# EAGLE design IVSTAGEV4 (EAGLE 5.07)
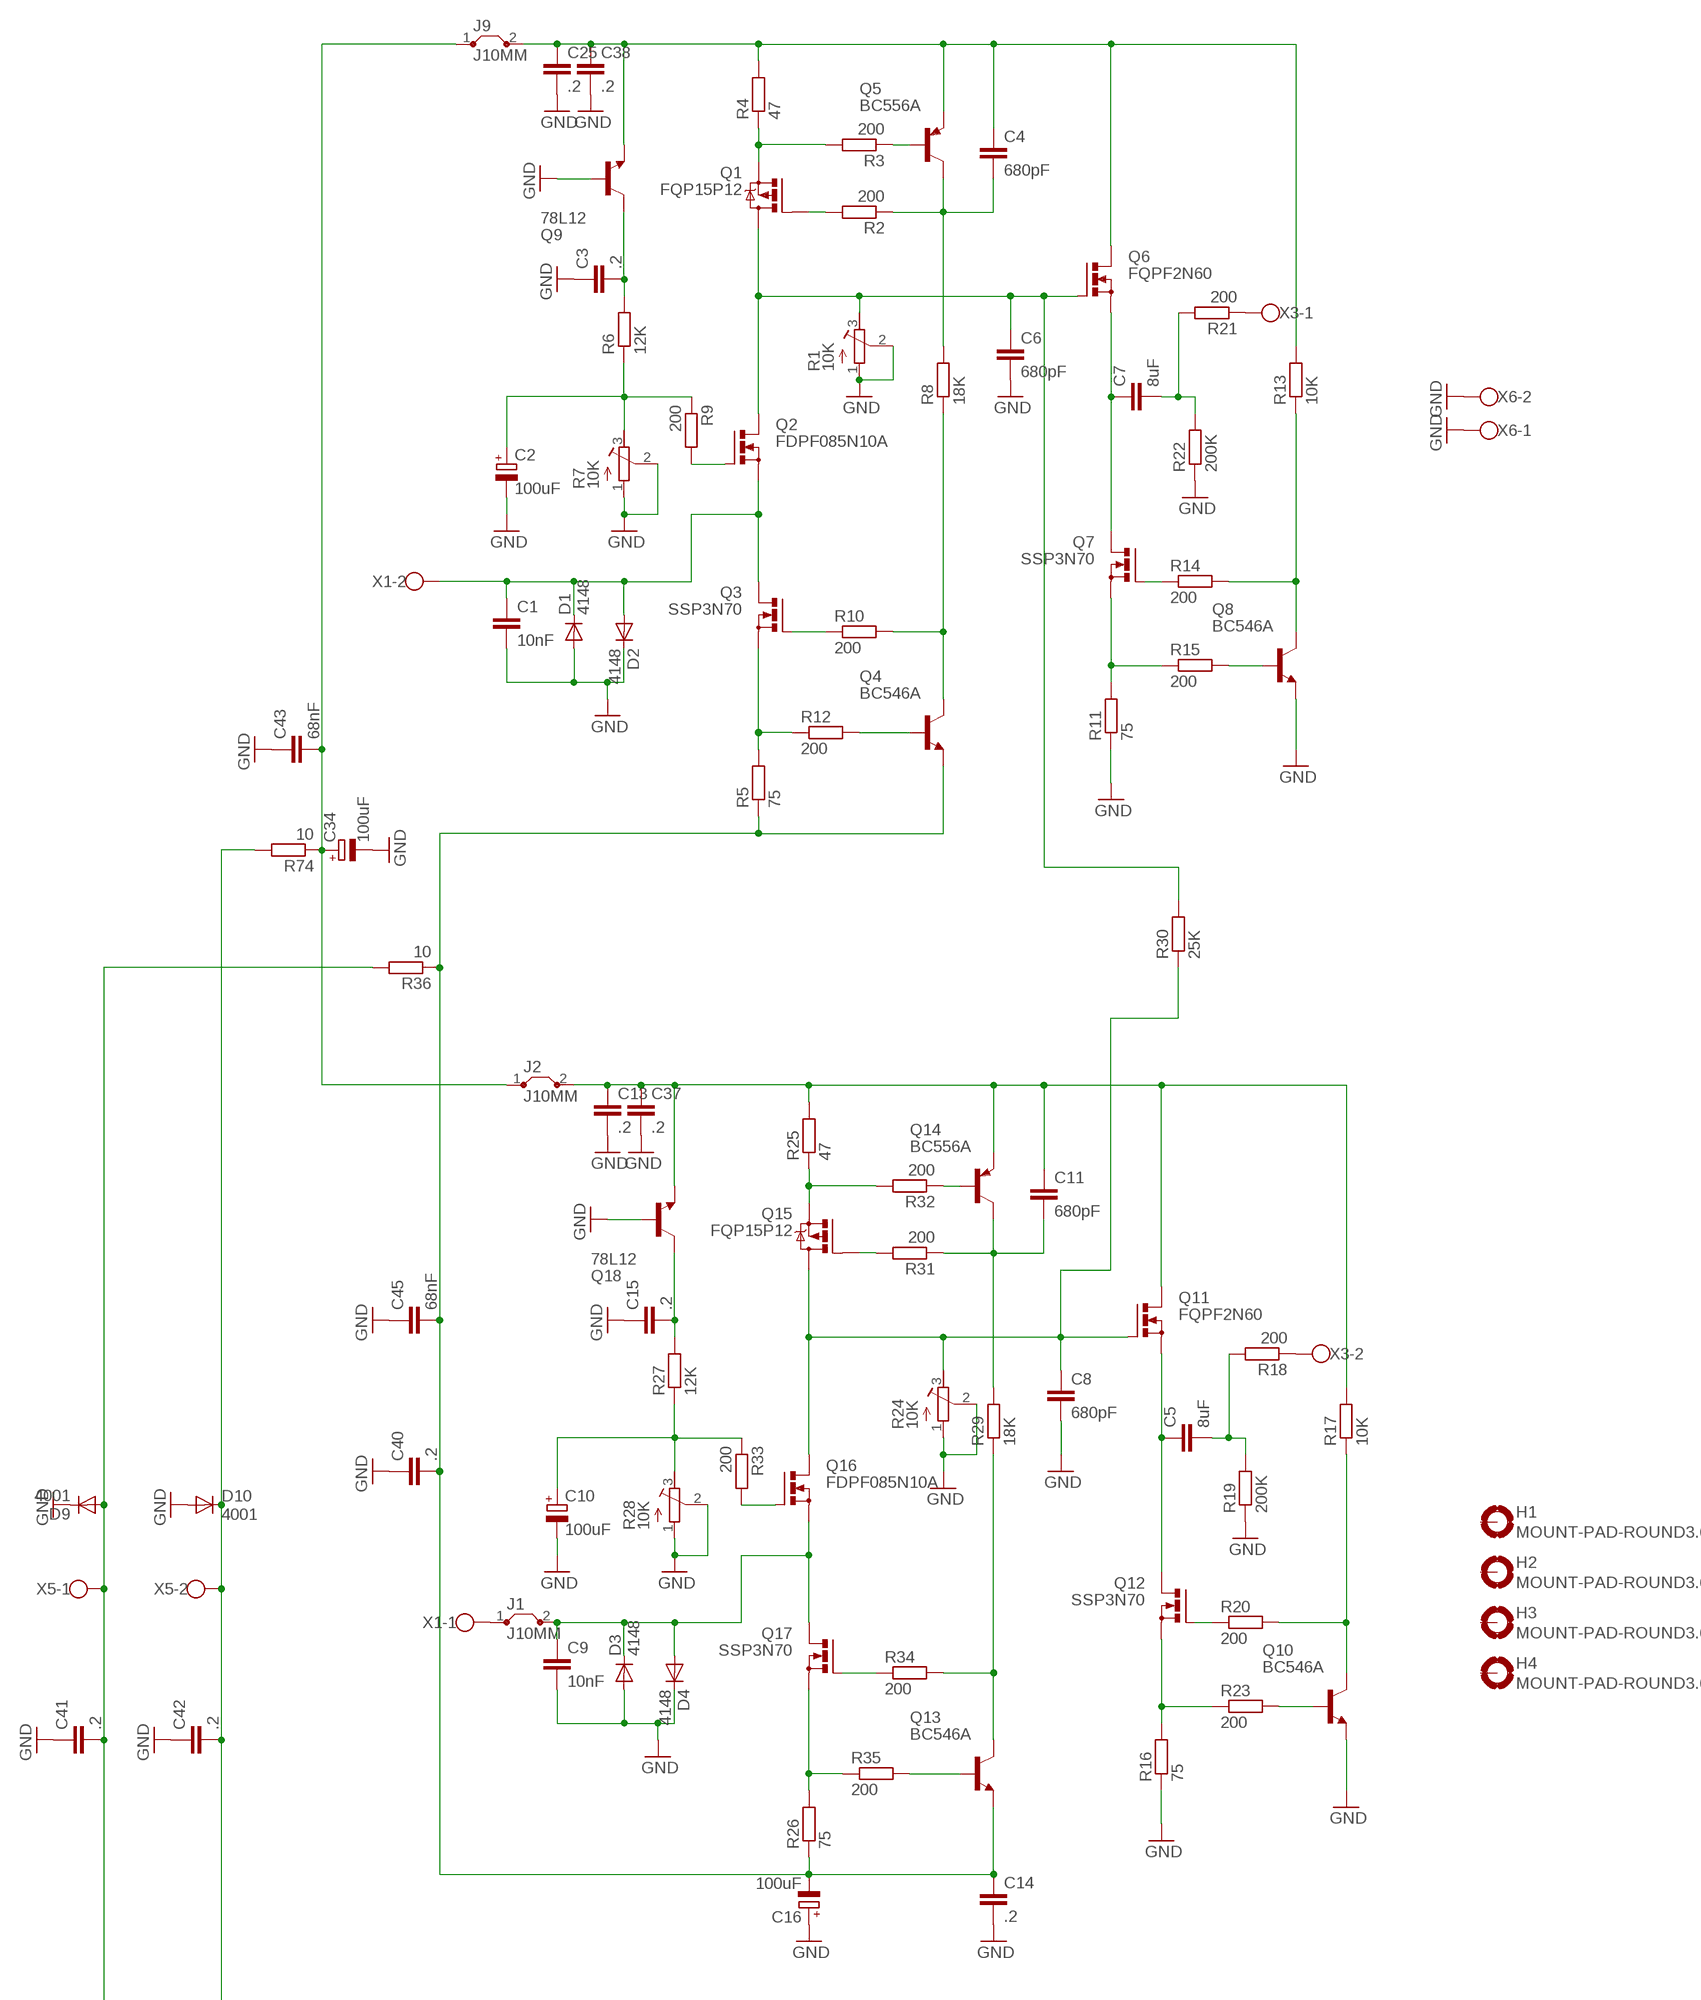
[diagram p0: schematic, sheet 1, part 1 of 2]
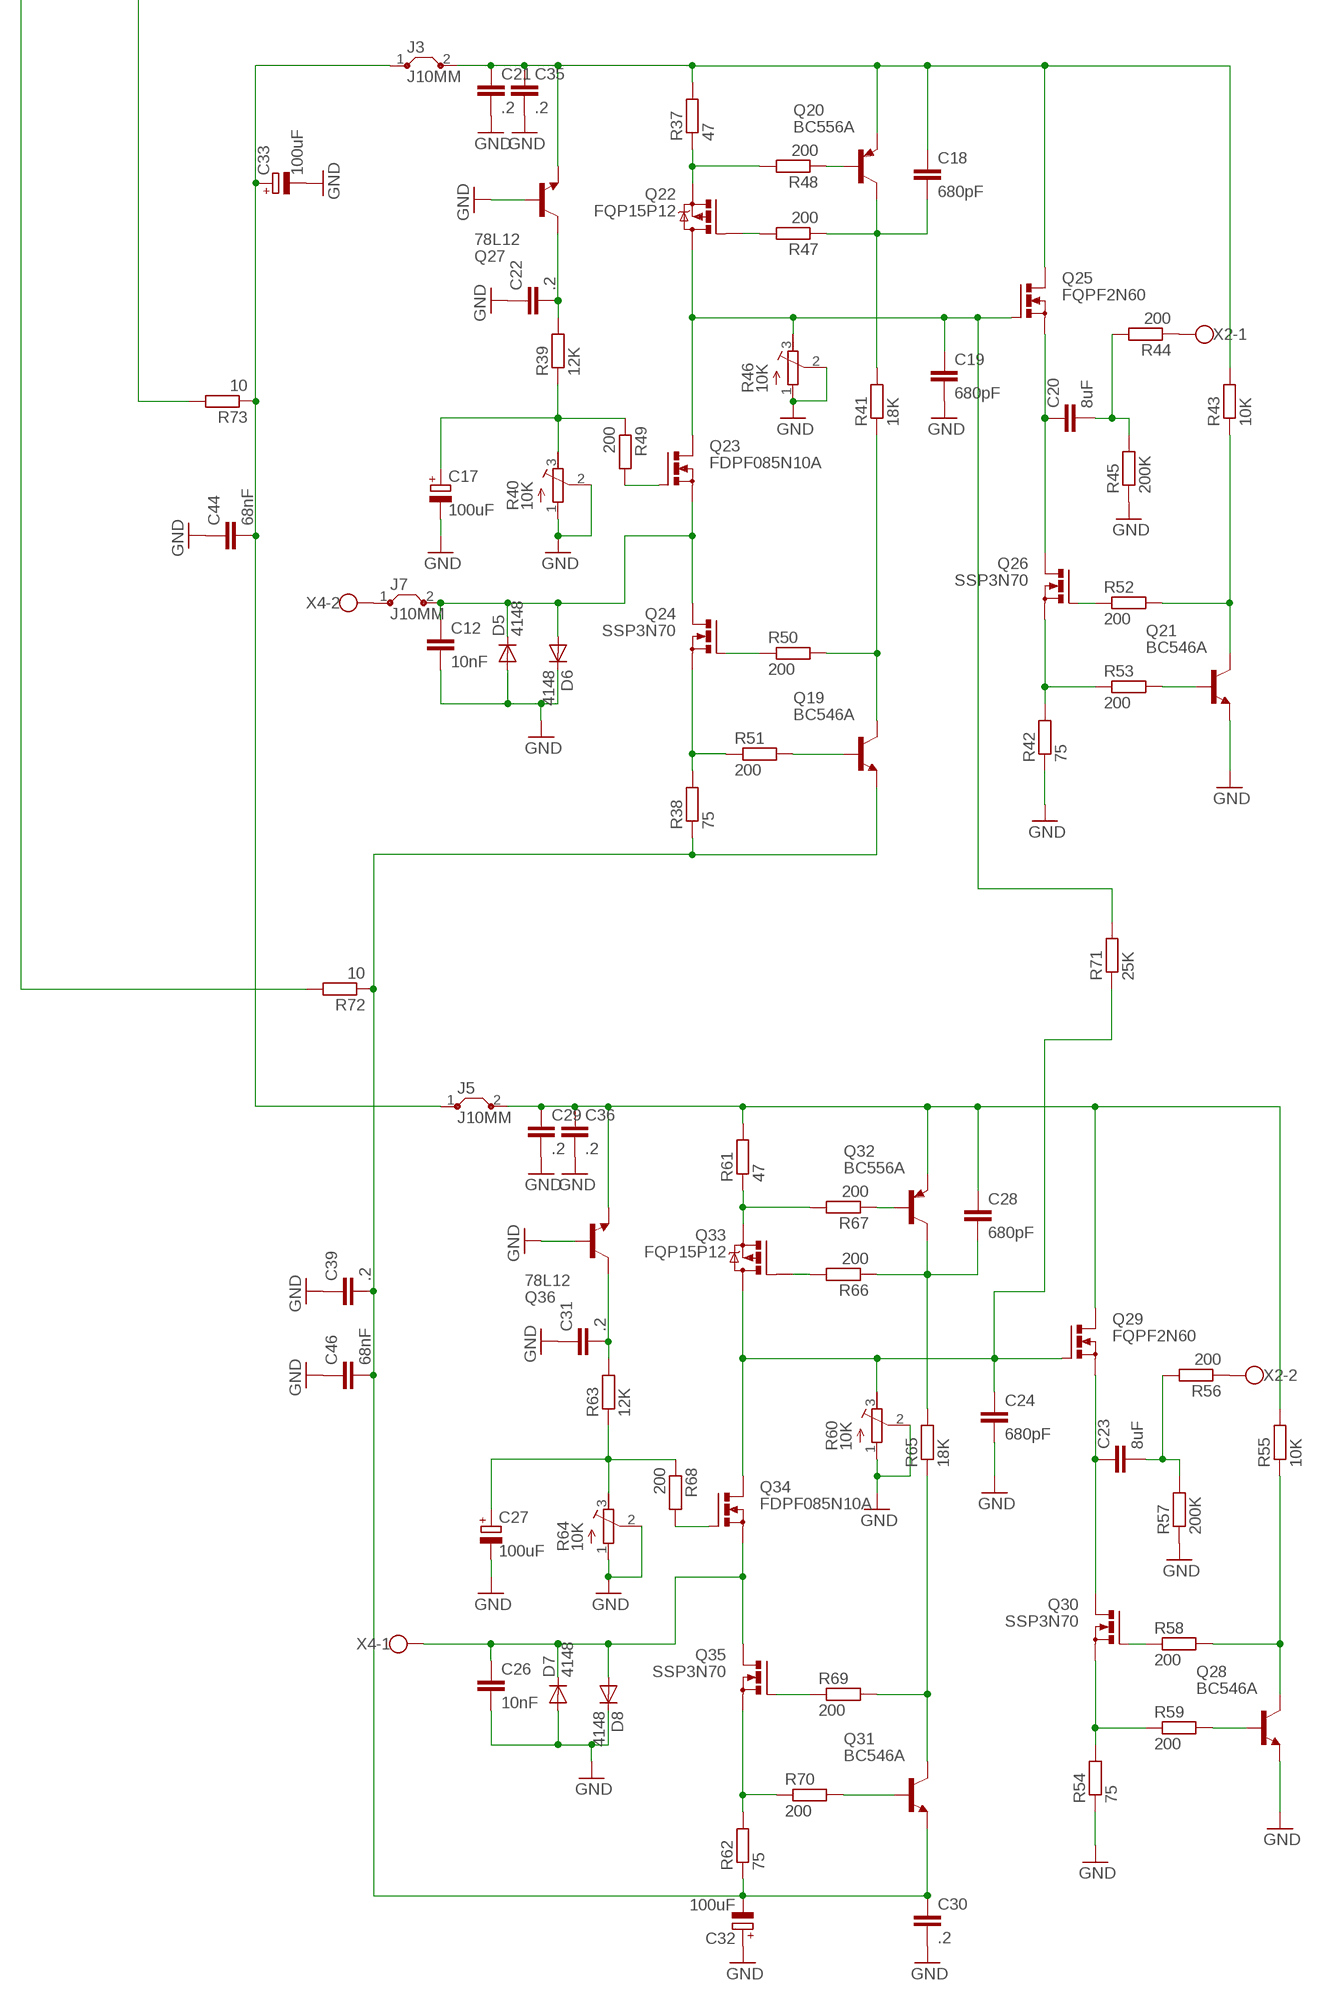
[diagram p1: schematic, sheet 1, part 2 of 2]

## Parts
C1  10nF  C-EU050-055X075  [C050-055X075]
C2  100uF  CPOL-EUE5-10.5  [E5-10,5]
C3  .2  C-EUC1210K  [C1210K]
C4  680pF  C-EU050-055X075  [C050-055X075]
C5  8uF  C-EU275-173X316  [C275-173X316]
C6  680pF  C-EU050-055X075  [C050-055X075]
C7  8uF  C-EU275-173X316  [C275-173X316]
C8  680pF  C-EU050-055X075  [C050-055X075]
C9  10nF  C-EU050-055X075  [C050-055X075]
C10  100uF  CPOL-EUE5-10.5  [E5-10,5]
C11  680pF  C-EU050-055X075  [C050-055X075]
C12  10nF  C-EU050-055X075  [C050-055X075]
C13  .2  C-EUC1210K  [C1210K]
C14  .2  C-EUC1210K  [C1210K]
C15  .2  C-EUC1210K  [C1210K]
C16  100uF  CPOL-EUE5-13  [E5-13]
C17  100uF  CPOL-EUE5-10.5  [E5-10,5]
C18  680pF  C-EU050-055X075  [C050-055X075]
C19  680pF  C-EU050-055X075  [C050-055X075]
C20  8uF  C-EU275-173X316  [C275-173X316]
C21  .2  C-EUC1210K  [C1210K]
C22  .2  C-EUC1210K  [C1210K]
C23  8uF  C-EU275-173X316  [C275-173X316]
C24  680pF  C-EU050-055X075  [C050-055X075]
C25  .2  C-EUC1210K  [C1210K]
C26  10nF  C-EU050-055X075  [C050-055X075]
C27  100uF  CPOL-EUE5-10.5  [E5-10,5]
C28  680pF  C-EU050-055X075  [C050-055X075]
C29  .2  C-EUC1210K  [C1210K]
C30  .2  C-EUC1210K  [C1210K]
C31  .2  C-EUC1210K  [C1210K]
C32  100uF  CPOL-EUE5-13  [E5-13]
C33  100uF  CPOL-EUE5-13  [E5-13]
C34  100uF  CPOL-EUE5-13  [E5-13]
C35  .2  C-EUC1210K  [C1210K]
C36  .2  C-EUC1210K  [C1210K]
C37  .2  C-EUC1210K  [C1210K]
C38  .2  C-EUC1210K  [C1210K]
C39  .2  C-EUC1210K  [C1210K]
C40  .2  C-EUC1210K  [C1210K]
C41  .2  C-EUC1210K  [C1210K]
C42  .2  C-EUC1210K  [C1210K]
C43  68nF  C-EU075-052X106  [C075-052X106]
C44  68nF  C-EU075-052X106  [C075-052X106]
C45  68nF  C-EU075-052X106  [C075-052X106]
C46  68nF  C-EU075-052X106  [C075-052X106]
D1  4148  1N4148DO35-7  [DO35-7]
D2  4148  1N4148DO35-7  [DO35-7]
D3  4148  1N4148DO35-7  [DO35-7]
D4  4148  1N4148DO35-7  [DO35-7]
D5  4148  1N4148DO35-7  [DO35-7]
D6  4148  1N4148DO35-7  [DO35-7]
D7  4148  1N4148DO35-7  [DO35-7]
D8  4148  1N4148DO35-7  [DO35-7]
D9  4001  1N4148DO35-7  [DO35-7]
D10  4001  1N4148DO35-7  [DO35-7]
H1  MOUNT-PAD-ROUND3.6  [3,6-PAD]
H2  MOUNT-PAD-ROUND3.6  [3,6-PAD]
H3  MOUNT-PAD-ROUND3.6  [3,6-PAD]
H4  MOUNT-PAD-ROUND3.6  [3,6-PAD]
J1  J10MM  [10]
J2  J10MM  [10]
J3  J10MM  [10]
J5  J10MM  [10]
J7  J10MM  [10]
J9  J10MM  [10]
Q1  FQP15P12  IRF9530  [TO220BV]
Q2  FDPF085N10A  IRF512  [TO220BV]
Q3  SSP3N70  IRF512  [TO220BV]
Q4  BC546A  [TO92-EBC]
Q5  BC556A  BC556  [TO92-EBC]
Q6  FQPF2N60  IRF512  [TO220BV]
Q7  SSP3N70  IRF512  [TO220BV]
Q8  BC546A  [TO92-EBC]
Q9  78L12  BC546A  [TO92-EBC]
Q10  BC546A  [TO92-EBC]
Q11  FQPF2N60  IRF512  [TO220BV]
Q12  SSP3N70  IRF512  [TO220BV]
Q13  BC546A  [TO92-EBC]
Q14  BC556A  BC556  [TO92-EBC]
Q15  FQP15P12  IRF9530  [TO220BV]
Q16  FDPF085N10A  IRF512  [TO220BV]
Q17  SSP3N70  IRF512  [TO220BV]
Q18  78L12  BC546A  [TO92-EBC]
Q19  BC546A  [TO92-EBC]
Q20  BC556A  BC556  [TO92-EBC]
Q21  BC546A  [TO92-EBC]
Q22  FQP15P12  IRF9530  [TO220BV]
Q23  FDPF085N10A  IRF512  [TO220BV]
Q24  SSP3N70  IRF512  [TO220BV]
Q25  FQPF2N60  IRF512  [TO220BV]
Q26  SSP3N70  IRF512  [TO220BV]
Q27  78L12  BC546A  [TO92-EBC]
Q28  BC546A  [TO92-EBC]
Q29  FQPF2N60  IRF512  [TO220BV]
Q30  SSP3N70  IRF512  [TO220BV]
Q31  BC546A  [TO92-EBC]
Q32  BC556A  BC556  [TO92-EBC]
Q33  FQP15P12  IRF9530  [TO220BV]
Q34  FDPF085N10A  IRF512  [TO220BV]
Q35  SSP3N70  IRF512  [TO220BV]
Q36  78L12  BC546A  [TO92-EBC]
R1  10K  R-TRIMM3296W  [RTRIM3296W]
R2  200  R-EU_0207/10  [0207/10]
R3  200  R-EU_0207/10  [0207/10]
R4  47  R-EU_0207/10  [0207/10]
R5  75  R-EU_0207/10  [0207/10]
R6  12K  R-EU_0204/7  [0204/7]
R7  10K  R-TRIMM3296W  [RTRIM3296W]
R8  18K  R-EU_0309/12  [0309/12]
R9  200  R-EU_0207/10  [0207/10]
R10  200  R-EU_0207/10  [0207/10]
R11  75  R-EU_0207/10  [0207/10]
R12  200  R-EU_0207/10  [0207/10]
R13  10K  R-EU_0309/12  [0309/12]
R14  200  R-EU_0207/10  [0207/10]
R15  200  R-EU_0207/10  [0207/10]
R16  75  R-EU_0207/10  [0207/10]
R17  10K  R-EU_0309/12  [0309/12]
R18  200  R-EU_0207/10  [0207/10]
R19  200K  R-EU_0207/10  [0207/10]
R20  200  R-EU_0207/10  [0207/10]
R21  200  R-EU_0207/10  [0207/10]
R22  200K  R-EU_0207/10  [0207/10]
R23  200  R-EU_0207/10  [0207/10]
R24  10K  R-TRIMM3296W  [RTRIM3296W]
R25  47  R-EU_0207/10  [0207/10]
R26  75  R-EU_0207/10  [0207/10]
R27  12K  R-EU_0204/7  [0204/7]
R28  10K  R-TRIMM3296W  [RTRIM3296W]
R29  18K  R-EU_0309/12  [0309/12]
R30  25K  R-EU_0207/10  [0207/10]
R31  200  R-EU_0207/10  [0207/10]
R32  200  R-EU_0207/10  [0207/10]
R33  200  R-EU_0207/10  [0207/10]
R34  200  R-EU_0207/10  [0207/10]
R35  200  R-EU_0207/10  [0207/10]
R36  10  R-EU_0207/10  [0207/10]
R37  47  R-EU_0207/10  [0207/10]
R38  75  R-EU_0207/10  [0207/10]
R39  12K  R-EU_0204/7  [0204/7]
R40  10K  R-TRIMM3296W  [RTRIM3296W]
R41  18K  R-EU_0309/12  [0309/12]
R42  75  R-EU_0207/10  [0207/10]
R43  10K  R-EU_0309/12  [0309/12]
R44  200  R-EU_0207/10  [0207/10]
R45  200K  R-EU_0207/10  [0207/10]
R46  10K  R-TRIMM3296W  [RTRIM3296W]
R47  200  R-EU_0207/10  [0207/10]
R48  200  R-EU_0207/10  [0207/10]
R49  200  R-EU_0207/10  [0207/10]
R50  200  R-EU_0207/10  [0207/10]
R51  200  R-EU_0207/10  [0207/10]
R52  200  R-EU_0207/10  [0207/10]
R53  200  R-EU_0207/10  [0207/10]
R54  75  R-EU_0207/10  [0207/10]
R55  10K  R-EU_0309/12  [0309/12]
R56  200  R-EU_0207/10  [0207/10]
R57  200K  R-EU_0207/10  [0207/10]
R58  200  R-EU_0207/10  [0207/10]
R59  200  R-EU_0207/10  [0207/10]
R60  10K  R-TRIMM3296W  [RTRIM3296W]
R61  47  R-EU_0207/10  [0207/10]
R62  75  R-EU_0207/10  [0207/10]
R63  12K  R-EU_0204/7  [0204/7]
R64  10K  R-TRIMM3296W  [RTRIM3296W]
R65  18K  R-EU_0309/12  [0309/12]
R66  200  R-EU_0207/10  [0207/10]
R67  200  R-EU_0207/10  [0207/10]
R68  200  R-EU_0207/10  [0207/10]
R69  200  R-EU_0207/10  [0207/10]
R70  200  R-EU_0207/10  [0207/10]
R71  25K  R-EU_0207/10  [0207/10]
R72  10  R-EU_0207/10  [0207/10]
R73  10  R-EU_0207/10  [0207/10]
R74  10  R-EU_0207/10  [0207/10]
X1  W237-02P  [W237-132]
X2  W237-02P  [W237-132]
X3  W237-02P  [W237-132]
X4  W237-02P  [W237-132]
X5  W237-02P  [W237-132]
X6  W237-02P  [W237-132]

## Nets
GND: C1.2 C2.- C3.1 C6.2 C8.2 C9.2 C10.- C12.2 C13.2 C14.2 C15.1 C16.+ C17.- C19.2 C21.2 C22.1 C24.2 C25.2 C26.2 C27.- C29.2 C30.2 C31.1 C32.+ C33.- C34.- C35.2 C36.2 C37.2 C38.2 C39.1 C40.1 C41.1 C42.1 C43.1 C44.1 C45.1 C46.1 D1.A D2.C D3.A D4.C D5.A D6.C D7.A D8.C D9.C D10.A Q8.E Q9.B Q10.E Q18.B Q21.E Q27.B Q28.E Q36.B R1.1(E) R1.2(S) R7.1(E) R7.2(S) R11.1 R16.1 R19.1 R22.1 R24.1(E) R24.2(S) R28.1(E) R28.2(S) R40.1(E) R40.2(S) R42.1 R45.1 R46.1(E) R46.2(S) R54.1 R57.1 R60.1(E) R60.2(S) R64.1(E) R64.2(S) X6.1 X6.2
N$1: C6.1 Q1.D Q2.D Q6.G R1.3(A) R30.2
N$2: C1.1 D1.C D2.A Q2.S Q3.D X1.2
N$3: C2.+ R6.1 R7.3(A) R9.1
N$4: Q1.G R2.2
N$5: C3.2 Q9.C R6.2
N$6: Q1.S R3.2 R4.1
N$7: Q3.S R5.2 R12.1
N$8: Q4.C R8.1 R10.2
N$9: C4.2 Q5.C R2.1 R8.2
N$10: C14.1 C16.- C40.2 C45.2 Q4.E Q13.E R5.1 R26.1 R36.1
N$11: C4.1 C25.1 C38.1 J9.2 Q5.E Q6.D Q9.E R4.2 R13.2
N$12: Q5.B R3.1
N$13: C7.1 Q6.S Q7.D
N$14: Q7.S R11.2 R15.1
N$15: Q2.G R9.2
N$16: Q8.C R13.1 R14.2
N$17: Q3.G R10.1
N$18: Q4.B R12.2
N$19: Q7.G R14.1
N$20: Q8.B R15.2
N$21: R21.1 X3.1
N$22: C41.2 D9.A R36.2 R72.2 X5.1
N$23: C5.1 Q11.S Q12.D
N$24: Q12.S R16.2 R23.1
N$25: Q10.C R17.1 R20.2
N$26: C7.2 R21.2 R22.2
N$27: C5.2 R18.2 R19.2
N$28: Q12.G R20.1
N$29: Q10.B R23.2
N$30: C8.1 Q11.G Q15.D Q16.D R24.3(A) R30.1
N$31: C9.1 D3.C D4.A J1.2 Q16.S Q17.D
N$32: C10.+ R27.1 R28.3(A) R33.1
N$42: Q15.S R25.1 R32.2
N$43: Q17.S R26.2 R35.1
N$44: Q13.C R29.1 R34.2
N$45: C11.2 Q14.C R29.2 R31.1
N$52: R18.1 X3.2
N$53: C42.2 D10.C R73.2 R74.2 X5.2
N$55: C34.+ C43.2 J2.1 J9.1 R74.1
N$56: C15.2 Q18.C R27.2
N$57: C19.1 Q22.D Q23.D Q25.G R46.3(A) R71.2
N$58: Q15.G R31.2
N$59: Q14.B R32.1
N$60: Q16.G R33.2
N$61: Q17.G R34.1
N$62: Q13.B R35.2
N$63: J1.1 X1.1
N$64: C12.1 D5.C D6.A J7.2 Q23.S Q24.D
N$65: C17.+ R39.1 R40.3(A) R49.1
N$66: Q22.S R37.1 R48.2
N$67: Q24.S R38.2 R51.1
N$68: Q19.C R41.1 R50.2
N$69: C18.2 Q20.C R41.2 R47.1
N$70: C30.1 C32.- C39.2 C46.2 Q19.E Q31.E R38.1 R62.1 R72.1
N$71: C18.1 C21.1 C35.1 J3.2 Q20.E Q25.D Q27.E R37.2 R43.2
N$72: C20.1 Q25.S Q26.D
N$73: Q26.S R42.2 R53.1
N$74: Q21.C R43.1 R52.2
N$75: C20.2 R44.2 R45.2
N$76: C22.2 Q27.C R39.2
N$77: Q22.G R47.2
N$78: Q20.B R48.1
N$79: Q23.G R49.2
N$80: Q24.G R50.1
N$81: Q19.B R51.2
N$82: Q26.G R52.1
N$83: Q21.B R53.2
N$84: Q29.D R55.2
N$85: C23.1 Q29.S Q30.D
N$86: Q30.S R54.2 R59.1
N$87: Q28.C R55.1 R58.2
N$88: C23.2 R56.2 R57.2
N$89: Q30.G R58.1
N$90: Q28.B R59.2
N$91: C24.1 Q29.G Q33.D Q34.D R60.3(A) R71.1
N$92: C26.1 D7.C D8.A Q34.S Q35.D X4.1
N$93: C27.+ R63.1 R64.3(A) R68.1
N$94: Q33.S R61.1 R67.2
N$95: Q35.S R62.2 R70.1
N$96: Q31.C R65.1 R69.2
N$97: C28.2 Q32.C R65.2 R66.1
N$98: C28.1 C29.1 C36.1 J5.2 Q32.E Q36.E R61.2
N$99: C33.+ C44.2 J3.1 J5.1 R73.1
N$100: C31.2 Q36.C R63.2
N$101: Q33.G R66.2
N$102: Q32.B R67.1
N$103: Q34.G R68.2
N$104: Q35.G R69.1
N$105: Q31.B R70.2
N$106: R44.1 X2.1
N$107: R56.1 X2.2
N$108: J7.1 X4.2
N$110: C11.1 C13.1 C37.1 J2.2 Q11.D Q14.E Q18.E R17.2 R25.2
Unconnected: H1.B3,6(MOUNT) H2.B3,6(MOUNT) H3.B3,6(MOUNT) H4.B3,6(MOUNT)

## Library data of the parts
C1 C3-C9 C11-C15 C18-C26 C28-C31 C35-C46 = resistor:C-EU: CAPACITOR, European symbol
C2 C10 C16 C17 C27 C32-C34 = resistor:CPOL-EU: POLARIZED CAPACITOR, European symbol
D1-D10 = diode:1N4148: DIODE high speed (Philips)
H1-H4 = holes:MOUNT-PAD-ROUND: MOUNTING PAD, round
J1-J3 J5 J7 J9 = jumper:J: Bridge
Q1 Q15 Q22 Q33 = transistor-power:IRF9530: P-CHANNEL HEXFET POWER-MOS-FET Source: http://www.irf.com/product-info/datasheets/data/irf9530.pdf
Q2 Q3 Q6 Q7 Q11 Q12 Q16 Q17 Q23-Q26 Q29 Q30 Q34 Q35 = transistor-power:IRF512: N-CHANNEL MOS FET
Q4 Q8-Q10 Q13 Q18 Q19 Q21 Q27 Q28 Q31 Q36 = transistor-npn:BC546*: NPN Transistor
Q5 Q14 Q20 Q32 = transistor-pnp:BC556*: PNP Transistror
R1 R7 R24 R28 R40 R46 R60 R64 = resistor:R-TRIMM: Trimm resistor
R2-R6 R8-R23 R25-R27 R29-R39 R41-R45 R47-R59 R61-R63 R65-R74 = resistor:R-EU_: RESISTOR, European symbol
X1-X6 = con-wago-508:W237-02P: WAGO SREW CLAMP

## Board
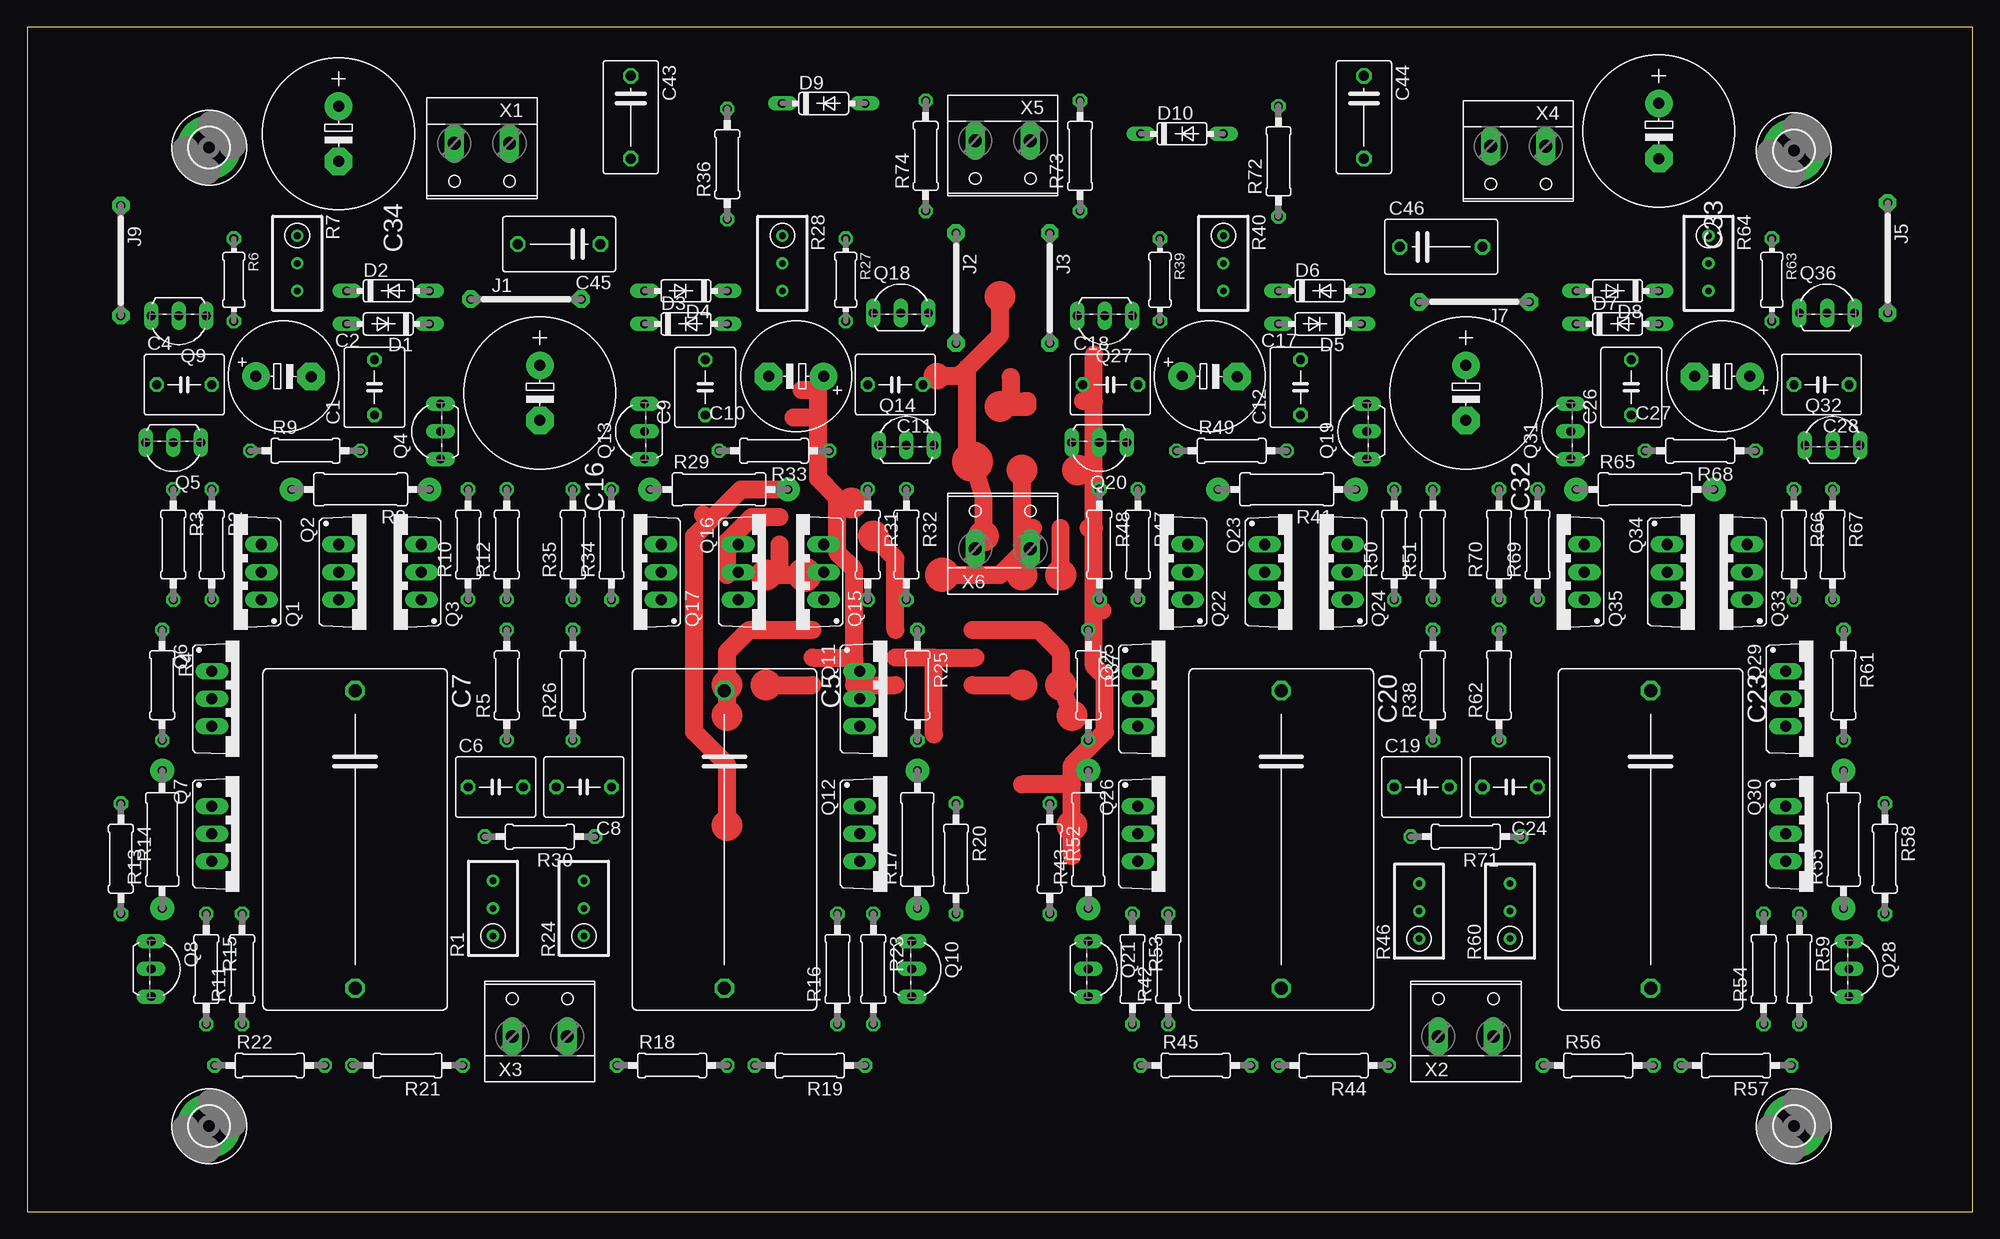
[diagram p2: board, top side]
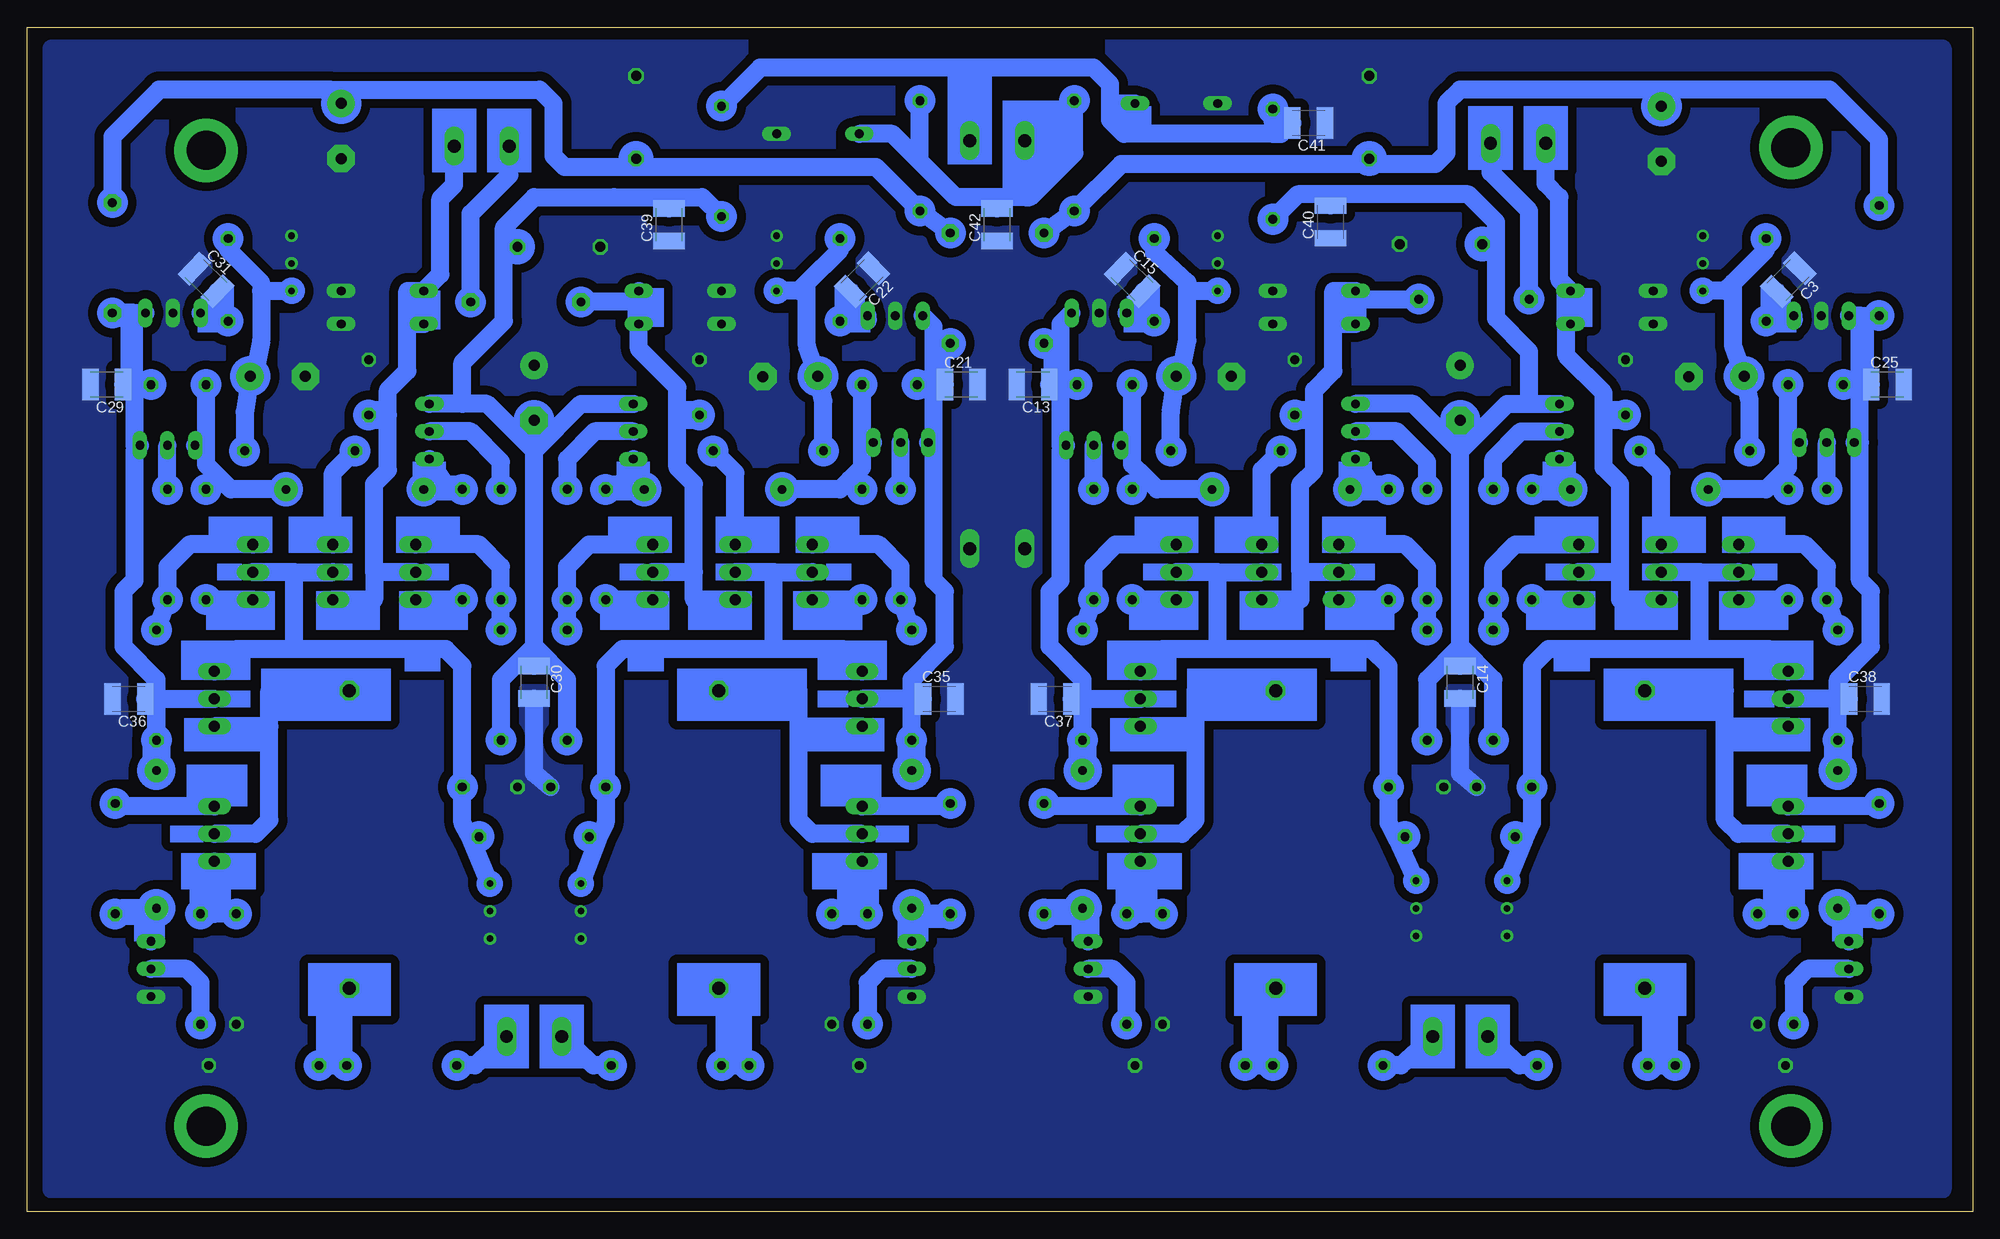
[diagram p3: board, bottom side, seen from below]

Size 179.3 x 109.14 mm. Coordinates in mm from the lower left corner, seen from the top.
Outline: 0,0 179.3,0 179.3,109.14 0,109.14 0,0
Copper layers (1*16): Top 0.035mm / dielectric 1.5mm / Bottom 0.035mm
Design rules "default *": minimum track width 10mil, minimum drill 24mil, track to track 8mil, track to pad 8mil, pad to pad 8mil, via to via 8mil, smd to smd 8mil, copper to edge 40mil, drill to drill 8mil, minimum pad ring 10mil, minimum via ring 8mil, stop-mask expansion 4mil, vias tented up to drill 0mil, thermal gap 10mil

### Footprints (pad centres in the part's own frame; a part is rotated, then mirrored left to right if it is on the bottom)
C050-055X075 = drill 0.813 octagon: 1 -2.54,0; 2 2.54,0
E5-10,5 = drill 1.016 pad 2.54 round: + -2.54,0 | drill 1.016 pad 2.54 octagon: - 2.54,0
C1210K = smd 1.5 x 2.9: 1 -1.5,0; 2 1.5,0
C275-173X316 = drill 1.194 octagon: 1 -13.716,0; 2 13.716,0
E5-13 = drill 1.016 pad 2.54 round: + -2.54,0 | drill 1.016 pad 2.54 octagon: - 2.54,0
C075-052X106 = drill 0.914 octagon: 1 -3.81,0; 2 3.81,0
DO35-7 = drill 0.813 long: A 3.81,0; C -3.81,0
3,6-PAD = drill 3.6 pad 5.842 round: B3,6 0,0
10 = drill 0.813 pad 1.6 octagon: 1 -5.08,0; 2 5.08,0
TO220BV = drill 1.016 long: D 0,-2.54; G -2.54,-2.54; S 2.54,-2.54
TO92-EBC = drill 0.813 long: B 0,-1.27; C -2.54,-1.27; E 2.54,-1.27
RTRIM3296W = drill 0.61 round: 1 0,-2.54; 2 0,0; 3 0,2.54
0207/10 = drill 0.813 octagon: 1 -5.08,0; 2 5.08,0
0204/7 = drill 0.813 octagon: 1 -3.81,0; 2 3.81,0
0309/12 = drill 0.8 pad 2.184 round: 1 -6.35,0; 2 6.35,0
W237-132 = drill 1.194 long: 1 -2.54,-0.635; 2 2.54,-0.635

### Placement (x,y rotation side)
C1  32,75.95 90 top
C2  23.62,76.96 359.3 top
C3  17.02,85.85 225 bottom
C4  14.48,76.2 0 top
C5  64.26,34.29 270 top
C6  43.18,39.12 0 top
C7  30.23,34.29 270 top
C8  51.31,39.12 180 top
C9  62.48,75.95 90 top
C10  70.87,76.96 180 top
C11  80.01,76.2 180 top
C12  117.35,75.95 90 top
C13  86.61,76.2 180 bottom
C14  47.24,48.77 270 bottom
C15  77.47,85.85 315.9 bottom
C16  47.24,75.44 270 top
C17  108.97,76.96 359.3 top
C18  99.82,76.2 0 top
C19  128.52,39.12 0 top
C20  115.57,34.29 270 top
C21  93.22,76.2 0 bottom
C22  102.36,85.85 225 bottom
C23  149.61,34.29 270 top
C24  136.65,39.12 180 top
C25  7.87,76.2 0 bottom
C26  147.83,75.95 90 top
C27  156.21,76.96 180 top
C28  165.35,76.2 180 top
C29  171.96,76.2 180 bottom
C30  132.59,48.77 270 bottom
C31  162.81,85.85 315.9 bottom
C32  132.59,75.44 270 top
C33  150.37,99.57 270 top
C34  28.7,99.31 270 top
C35  95.25,47.24 0 bottom
C36  169.93,47.24 180 bottom
C37  84.58,47.24 180 bottom
C38  9.91,47.24 0 bottom
C39  120.14,90.93 90 bottom
C40  59.18,91.19 90 bottom
C41  61.21,100.33 180 bottom
C42  89.92,90.93 90 bottom
C43  55.63,100.84 270 top
C44  123.19,100.84 270 top
C45  49.02,89.15 180 top
C46  130.3,88.9 0 top
D1  33.27,81.79 180 top
D2  33.27,84.84 0 top
D3  60.71,81.79 0 top
D4  60.71,84.84 180 top
D5  119.13,81.79 180 top
D6  119.13,84.84 0 top
D7  146.56,81.79 0 top
D8  146.56,84.84 180 top
D9  73.41,102.11 0 top
D10  106.43,99.31 0 top
H1  16.76,7.87 0 top
H2  162.81,7.87 0 top
H3  16.76,98.04 0 top
H4  162.81,97.79 0 top
J1  45.97,84.07 0 top
J2  85.6,85.09 270 top
J3  94.23,85.09 270 top
J5  171.45,87.88 270 top
J7  133.35,83.82 180 top
J9  8.64,87.63 270 top
Q1  19.05,58.93 90 top
Q2  31.24,58.93 270 top
Q3  33.78,58.93 90 top
Q4  36.83,71.88 90 top
Q5  13.46,69.6 180 top
Q6  19.56,47.24 270 top
Q7  19.56,34.8 270 top
Q8  12.7,22.35 270 top
Q9  13.97,81.28 180 top
Q10  82.8,22.35 270 top
Q11  79.25,47.24 270 top
Q12  79.25,34.8 270 top
Q13  55.63,71.88 90 top
Q14  81.03,71.88 0 top
Q15  70.87,58.93 90 top
Q16  68.07,58.93 270 top
Q17  55.88,58.93 90 top
Q18  80.52,84.07 0 top
Q19  122.17,71.88 90 top
Q20  98.81,69.6 180 top
Q21  99.06,22.35 270 top
Q22  104.39,58.93 90 top
Q23  116.59,58.93 270 top
Q24  119.13,58.93 90 top
Q25  104.9,47.24 270 top
Q26  104.9,34.8 270 top
Q27  99.31,81.28 180 top
Q28  169.16,22.35 270 top
Q29  164.59,47.24 270 top
Q30  164.59,34.8 270 top
Q31  140.97,71.88 90 top
Q32  166.37,71.88 0 top
Q33  155.96,58.93 90 top
Q34  153.67,58.93 270 top
Q35  140.97,58.93 90 top
Q36  165.86,84.07 0 top
R1  42.93,27.94 0 top
R2  17.02,61.47 270 top
R3  13.46,61.47 270 top
R4  12.45,48.51 270 top
R5  44.2,48.51 90 top
R6  19.05,85.85 270 top
R7  24.89,87.38 180 top
R8  30.73,66.55 180 top
R9  25.65,70.1 0 top
R10  40.64,61.47 90 top
R11  19.81,22.35 90 top
R12  44.2,61.47 90 top
R13  12.45,34.29 90 top
R14  8.64,32.51 270 top
R15  16.51,22.35 270 top
R16  74.68,22.35 90 top
R17  82.04,34.29 90 top
R18  59.44,13.46 0 top
R19  72.14,13.46 180 top
R20  85.6,32.51 270 top
R21  35.05,13.46 180 top
R22  22.35,13.46 0 top
R23  77.98,22.35 270 top
R24  51.31,27.94 0 top
R25  82.04,48.51 270 top
R26  50.29,48.51 90 top
R27  75.44,85.85 270 top
R28  69.6,87.38 180 top
R29  63.75,66.55 0 top
R30  47.24,34.54 180 top
R31  77.47,61.47 270 top
R32  81.03,61.47 270 top
R33  68.83,70.1 180 top
R34  53.85,61.47 90 top
R35  50.29,61.47 90 top
R36  64.52,96.52 90 top
R37  97.79,48.51 270 top
R38  129.54,48.51 90 top
R39  104.39,85.85 270 top
R40  110.24,87.38 180 top
R41  116.08,66.55 180 top
R42  105.16,22.35 90 top
R43  97.79,34.29 90 top
R44  120.4,13.46 180 top
R45  107.7,13.46 0 top
R46  128.27,27.69 0 top
R47  102.36,61.47 270 top
R48  98.81,61.47 270 top
R49  111,70.1 0 top
R50  125.98,61.47 90 top
R51  129.54,61.47 90 top
R52  94.23,32.51 270 top
R53  101.85,22.35 270 top
R54  160.02,22.35 90 top
R55  167.39,34.29 90 top
R56  144.78,13.46 0 top
R57  157.48,13.46 180 top
R58  171.2,32.51 270 top
R59  163.32,22.35 270 top
R60  136.65,27.69 0 top
R61  167.39,48.51 270 top
R62  135.64,48.51 90 top
R63  160.78,85.85 270 top
R64  154.94,87.38 180 top
R65  149.1,66.55 0 top
R66  162.81,61.47 270 top
R67  166.37,61.47 270 top
R68  154.18,70.1 180 top
R69  139.19,61.47 90 top
R70  135.64,61.47 90 top
R71  132.59,34.54 180 top
R72  115.32,96.77 90 top
R73  97.03,97.28 90 top
R74  82.8,97.28 90 top
X1  41.91,97.79 180 top
X2  132.59,16.76 0 top
X3  47.24,16.76 0 top
X4  137.41,97.54 180 top
X5  89.92,98.04 180 top
X6  89.92,61.72 0 top

### Tracks (layer width: path | path; a pad name or v marks a point on that pad's centre or on a via)
GND
  Bottom 1.676: C6.2 47.24,40.39 C14.2 | C19.2 132.59,40.39 C30.2
  pour Bottom (isolate 0.813, no thermals): 2.79,107.19 2.79,2.03 177.04,2.03 177.04,107.19
N$1
  Bottom 1.676: 25.15,58.93 Q1.D | 25.15,58.93 Q2.D | 25.15,51.82 25.15,58.93 | Q6.G 18.8,51.82 25.15,51.82 | 25.15,51.82 39.12,51.82 40.64,50.29 C6.1 40.64,35.81 41.36,34.28 | 41.36,34.28 R1.3 | R30.2 41.9,34.28 41.36,34.28
N$2
  Bottom 1.676: 32.51,58.93 32.51,56.39 Q2.S | 32.51,58.93 32.51,67.06 34.04,68.58 34.04,73.41 | 32.51,58.93 Q3.D | 34.04,73.41 C1.1 | 34.04,73.41 34.04,75.44 37.46,78.87 37.46,81.41 | 37.46,85.22 D2.A | 37.46,85.22 38.1,85.85 38.1,93.47 39.37,94.74 X1.2 | 37.46,81.41 37.46,85.22 | 37.46,81.41 D1.C
N$3
  Bottom 1.676: R9.1 20.57,74.71 C2.+ 22.1,79.79 22.1,85.6 | R6.1 19.05,88.65 22.1,85.6 | 22.1,85.6 22.86,84.84 R7.3
N$4
  Bottom 1.676: R2.2 Q1.G
N$5
  Bottom 1.676: C3.2 18.03,84.75 18.03,82.04 | 18.03,82.04 R6.2 | 18.03,82.04 16.51,82.04 16.51,82.3 16.76,82.55 Q9.C
N$6
  Bottom 1.676: R4.1 R3.2 13.46,59.44 15.49,61.47 Q1.S
N$7
  Bottom 1.676: Q3.S 42.16,61.47 44.2,59.44 R12.1 R5.2
N$8
  Bottom 1.676: R8.1 39.37,66.55 | 39.37,66.55 R10.2 | 39.37,66.55 Q4.C
N$9
  Bottom 1.676: 17.02,70.1 Q5.C | 17.02,70.1 C4.2 | 17.02,70.1 17.02,68.58 18.16,67.44 | 18.16,67.44 19.05,66.55 R8.2 | R2.1 17.91,67.44 18.16,67.44
N$10
  Bottom 1.676: 40.89,74.42 42.93,74.42 47.24,70.1 | 40.89,74.42 Q4.E | 47.24,52.07 44.2,49.02 R5.1 | Q13.E 51.56,74.42 47.24,70.1 | 47.24,52.07 50.29,49.02 R26.1 | 47.24,52.07 C14.1 | 47.24,52.07 47.24,70.1 | 47.24,70.1 C16.- | 43.94,89.15 43.94,82.3 40.89,79.25 40.89,74.42 | 43.94,89.15 43.94,91.19 46.48,93.73 59.18,93.73 | 59.18,93.73 62.23,93.73 R36.1 | 59.18,93.73 C40.2 | 43.94,89.15 C45.2
N$11
  Bottom 1.676: 12.45,47.24 R4.2 R13.2 | 12.45,47.24 12.45,49.02 9.4,52.07 9.4,57.15 10.41,58.17 10.41,70.87 | 10.41,76.2 C25.1 | 10.41,70.87 Q5.E | 10.41,70.87 10.41,76.2 | 10.41,76.2 C4.1 | 10.41,76.2 10.41,82.55 | 10.41,82.55 J9.2 | 12.45,47.24 Q6.D | 10.41,82.55 Q9.E | 12.45,47.24 C38.1
N$12
  Bottom 1.676: R3.1 Q5.B
N$13
  Bottom 1.676: Q7.D 21.59,34.8 22.86,36.07 22.86,44.7 | 22.86,44.7 Q6.S | C7.1 22.86,48.01 22.86,44.7
N$14
  Bottom 1.676: R15.1 17.02,27.43 | 17.02,27.43 R11.2 | 17.02,27.43 Q7.S
N$15
  Bottom 1.676: R9.2 28.7,68.07 Q2.G
N$16
  Bottom 1.676: 11.43,27.43 Q8.C | R14.2 11.43,27.43 | R13.1 11.94,27.94 11.43,27.43
N$17
  Bottom 1.676: Q3.G R10.1
N$18
  Bottom 1.676: Q4.B 41.66,71.88 44.2,69.34 R12.2
N$19
  Bottom 1.676: R14.1 8.89,37.34 Q7.G
N$20
  Bottom 1.676: R15.2 16.51,21.08 15.24,22.35 Q8.B
N$21
  Bottom 1.676: X3.1 41.78,13.46 R21.1
N$22
  Bottom 1.676: 92.46,105.41 X5.1 | 64.52,99.31 63.75,99.31 | 64.52,99.31 78.23,99.31 79.5,100.58 79.5,102.11 | 79.5,102.11 79.5,103.89 81.03,105.41 92.46,105.41 | 92.46,105.41 111.76,105.41 R72.2 | 64.52,100.33 64.52,99.31 | 64.52,100.33 R36.2 | C41.2 64.52,100.33 | 79.5,102.11 D9.A
N$23
  Bottom 1.676: Q12.D 72.9,34.8 71.63,36.07 71.63,44.7 | 71.63,44.7 71.63,48.01 C5.1 | 71.63,44.7 Q11.S
N$24
  Bottom 1.676: Q12.S 76.71,27.43 R23.1 R16.2
N$25
  Bottom 1.676: Q10.C 82.55,27.69 R17.1 85.34,27.94 R20.2
N$26
  Bottom 1.676: R22.2 28.7,13.46 | 28.7,13.46 R21.2 | C7.2 28.7,19.05 28.7,13.46
N$27
  Bottom 1.676: C5.2 64.52,19.81 65.79,18.54 65.79,13.46 | R18.2 65.79,13.46 | 65.79,13.46 R19.2
N$28
  Bottom 1.676: R20.1 85.6,37.34 Q12.G
N$29
  Bottom 1.676: Q10.B 79.25,22.35 77.98,21.08 R23.2
N$30
  Bottom 1.676: Q11.G 74.68,51.82 69.6,51.82 | 69.6,51.82 55.37,51.82 53.85,50.29 C8.1 53.85,35.81 53.05,34.3 | R24.3 53.05,34.3 | 69.6,58.93 Q16.D | 69.6,58.93 Q15.D | 69.6,51.82 69.6,58.93 | R30.1 52.57,34.3 53.05,34.3
N$31
  Bottom 1.676: Q17.D 61.98,58.93 | 61.98,58.93 61.98,56.39 Q16.S | 60.71,73.41 60.71,68.33 61.98,67.06 61.98,58.93 | 60.71,73.41 C9.1 | 60.71,73.41 60.71,75.69 58.93,77.47 58.93,81.79 | 58.93,81.79 58.93,83.06 | 58.93,83.06 58.93,84.84 D4.A | 58.93,81.79 D3.C | J1.2 58.67,84.07 58.93,83.06
N$32
  Bottom 1.676: 72.39,84.84 R28.3 | 72.39,84.84 72.39,80.26 72.9,77.72 C10.+ 73.91,73.66 R33.1 | R27.1 75.44,88.39 72.39,85.6 72.39,84.84
N$33
  Top 1.676: 83.57,51.05 87.38,51.05 | 83.57,51.05 80.01,51.05 | 83.57,43.94 83.57,51.05
N$34
  Top 1.676: 76.2,51.05 76.2,48.51 80.01,48.51 | 76.2,51.05 76.2,59.18 74.68,60.71 74.68,65.28 | 72.39,51.05 76.2,51.05 | 74.68,65.28 74.68,65.79 72.9,67.56 72.9,73.15 | 74.68,65.28 75.95,65.28 | 72.9,73.15 70.61,73.15 | 71.37,75.69 72.9,75.69 72.9,73.15
N$35
  Top 1.676: 88.14,62.23 88.14,65.82 87.12,69.12 86.61,69.63 86.61,77.72 | 89.66,84.33 89.66,80.77 86.61,77.72 | 86.61,77.72 85.85,76.96 83.82,76.96
N$36
  Top 1.676: 96.27,45.72 95.25,48.51 95.25,51.56 93.22,53.59 87.12,53.59
N$37
  Top 1.676: 72.39,53.59 66.55,53.59 64.52,51.56 64.52,45.72
N$38
  Top 1.676: 69.34,58.67 71.63,58.67 | 69.34,58.67 68.07,58.67 | 69.34,58.67 69.34,61.47
N$39
  Top 1.676: 91.69,62.23 92.71,62.99 | 91.69,62.23 91.69,68.33 | 91.69,62.23 91.69,60.71 90.55,59.56 | 90.55,59.56 89.66,58.67 84.33,58.67 | 91.69,58.67 90.81,59.56 90.55,59.56
N$40
  Top 1.676: 69.34,66.55 65.79,66.55 62.86,63.63 | 62.27,64.22 | 62.86,63.63 62.27,64.22 | 62.86,63.63 61.47,62.23 61.47,44.2 64.52,41.15 64.52,35.56
N$41
  Top 1.676: 98.3,55.37 98.3,50.29 99.31,49.28 99.31,44.2 96.27,41.15 96.27,39.37 | 98.3,55.37 99.08,55.37 | 98.3,55.37 98.3,62.99 | 98.3,62.99 97.79,62.99 | 98.3,62.99 98.3,68.33 | 98.3,68.33 96.77,68.33 | 98.3,68.33 98.3,74.68 | 98.3,74.68 98.3,78.99 | 96.27,39.37 91.69,39.37 | 96.27,32.77 96.27,39.37 | 98.3,74.68 97.28,74.68
N$42
  Bottom 1.676: Q15.S 78.99,61.47 81.03,59.44 R32.2 R25.1
N$43
  Bottom 1.676: R26.2 R35.1 50.29,59.44 52.32,61.47 Q17.S
N$44
  Bottom 1.676: 55.12,66.55 Q13.C | R34.2 55.12,66.55 | 55.12,66.55 R29.1
N$45
  Bottom 1.676: 77.47,70.61 Q14.C | 77.47,70.61 C11.2 | R29.2 75.18,66.55 76.33,67.69 | 76.33,67.69 77.47,68.83 77.47,70.61 | 76.33,67.69 R31.1
N$46
  Top 1.676: 90.63,76.92 90.68,76.87 90.68,74.17 | 90.68,74.17 89.66,74.17 | 90.68,74.17 92.2,74.17 92.2,74.42 91.95,74.68 92.2,74.68
N$47
  Top 1.676: 87.12,48.51 91.69,48.51
N$48
  Top 1.676: 95.25,58.67 95.25,62.99
N$49
  Top 1.676: 77.98,62.23 80.01,60.2 80.01,53.59
N$50
  Top 1.676: 68.07,48.51 72.39,48.51
N$51
  Top 1.676: 69.34,64.01 66.8,64.01 64.52,61.72 64.52,58.67
N$52
  Bottom 1.676: X3.2 52.7,13.46 R18.1
N$53
  Bottom 1.676: 97.03,96.77 R73.2 | 97.03,96.77 93.73,93.47 89.92,93.47 | 87.38,93.47 86.87,93.47 82.8,97.54 R74.2 | 87.38,93.47 89.92,93.47 | 87.38,93.47 X5.2 | 89.92,93.47 C42.2 | D10.C 99.57,99.31 97.03,96.77
N$55
  Bottom 1.676: J9.1 8.64,98.81 13.21,103.38 27.94,103.38 | 27.94,103.38 C34.+ | 27.94,103.38 47.24,103.38 48.51,102.11 48.51,97.54 49.53,96.52 55.63,96.52 | 55.63,96.52 78.49,96.52 R74.1 J2.1 | C43.2 55.37,97.28 55.37,96.77 55.63,96.52
N$56
  Bottom 1.676: R27.2 76.45,82.3 | 76.45,82.3 Q18.C | C15.2 76.45,84.75 76.45,82.3
N$57
  Bottom 1.676: 110.49,58.93 Q22.D | 110.49,58.93 Q23.D | 110.49,51.82 110.49,58.93 | Q25.G 104.14,51.82 110.49,51.82 | 110.49,51.82 124.46,51.82 125.98,50.29 C19.1 125.98,35.81 126.71,34.28 | 126.71,34.28 R46.3 | R71.2 127.25,34.28 126.71,34.28
N$58
  Bottom 1.676: Q15.G R31.2
N$59
  Bottom 1.676: R32.1 Q14.B
N$60
  Bottom 1.676: R33.2 65.53,68.33 Q16.G
N$61
  Bottom 1.676: R34.1 Q17.G
N$62
  Bottom 1.676: R35.2 50.29,69.09 53.09,71.88 Q13.B
N$63
  Bottom 1.676: X1.1 44.45,95.76 40.89,92.2 J1.1
N$64
  Bottom 1.676: 117.86,58.93 117.86,56.39 Q23.S | 117.86,58.93 117.86,67.06 119.38,68.58 119.38,73.41 | 117.86,58.93 Q24.D | 119.38,73.41 C12.1 | 119.38,73.41 119.38,75.95 122.94,79.5 D5.C 122.94,83.82 | 122.94,83.82 J7.2 | 122.94,83.82 D6.A
N$65
  Bottom 1.676: R49.1 105.92,74.71 C17.+ 107.44,79.79 107.44,85.6 | R39.1 104.39,88.65 107.44,85.6 | 107.44,85.6 108.2,84.84 R40.3
N$66
  Bottom 1.676: R37.1 R48.2 98.81,59.44 100.84,61.47 Q22.S
N$67
  Bottom 1.676: Q24.S 127.51,61.47 129.54,59.44 R51.1 R38.2
N$68
  Bottom 1.676: R41.1 124.71,66.55 | 124.71,66.55 R50.2 | 124.71,66.55 Q19.C
N$69
  Bottom 1.676: 102.36,70.1 Q20.C | 102.36,70.1 C18.2 | 102.36,70.1 102.36,68.58 103.51,67.44 | 103.51,67.44 104.39,66.55 R41.2 | R47.1 103.25,67.44 103.51,67.44
N$70
  Bottom 1.676: Q19.E 128.27,74.42 132.59,70.1 | 132.59,52.07 129.54,49.02 R38.1 | 139.19,74.42 136.91,74.42 132.59,70.1 | 139.19,74.42 Q31.E | 132.59,52.07 135.64,49.02 R62.1 | 132.59,52.07 C30.1 | 132.59,52.07 132.59,70.1 | 132.59,70.1 C32.- | 135.38,89.15 135.38,82.04 139.19,78.23 139.19,74.42 | 135.38,89.15 135.38,90.68 132.59,93.47 125.22,93.47 | R72.1 117.09,93.47 125.22,93.47 | C39.2 120.14,93.45 125.22,93.47 | C46.2 135.13,88.9 135.38,89.15
N$71
  Bottom 1.676: 97.79,47.24 R37.2 R43.2 | 97.79,47.24 97.79,49.02 94.74,52.07 94.74,57.15 95.76,58.17 95.76,70.87 | 95.76,70.87 Q20.E | 95.76,70.87 95.76,76.2 | 95.76,76.2 C18.1 | 95.76,76.2 95.76,80.01 | 95.76,80.01 95.76,81.53 Q27.E | 97.79,47.24 Q25.D | 95.76,80.01 J3.2 | 97.79,47.24 C35.1 | 95.76,76.2 C21.1
N$72
  Bottom 1.676: Q26.D 106.93,34.8 108.2,36.07 108.2,44.7 | 108.2,44.7 Q25.S | C20.1 108.2,48.01 108.2,44.7
N$73
  Bottom 1.676: R53.1 102.36,27.43 | 102.36,27.43 R42.2 | 102.36,27.43 Q26.S
N$74
  Bottom 1.676: 96.77,27.43 Q21.C | R52.2 96.77,27.43 | R43.1 97.28,27.94 96.77,27.43
N$75
  Bottom 1.676: R45.2 114.05,13.46 | 114.05,13.46 R44.2 | C20.2 114.05,19.05 114.05,13.46
N$76
  Bottom 1.676: C22.2 103.38,84.75 103.38,82.04 | 103.38,82.04 R39.2 | 103.38,82.04 101.85,82.04 101.85,82.3 102.11,82.55 Q27.C
N$77
  Bottom 1.676: R47.2 Q22.G
N$78
  Bottom 1.676: R48.1 Q20.B
N$79
  Bottom 1.676: R49.2 114.05,68.07 Q23.G
N$80
  Bottom 1.676: Q24.G R50.1
N$81
  Bottom 1.676: Q19.B 127,71.88 129.54,69.34 R51.2
N$82
  Bottom 1.676: R52.1 94.23,37.34 Q26.G
N$83
  Bottom 1.676: R53.2 101.85,21.08 100.58,22.35 Q21.B
N$84
  Bottom 1.676: Q29.D 167.39,47.24 R55.2
N$85
  Bottom 1.676: Q30.D 158.24,34.8 156.97,36.07 156.97,44.7 | 156.97,44.7 156.97,48.01 C23.1 | 156.97,44.7 Q29.S
N$86
  Bottom 1.676: Q30.S 162.05,27.43 R59.1 R54.2
N$87
  Bottom 1.676: Q28.C 167.89,27.69 R55.1 170.69,27.94 R58.2
N$88
  Bottom 1.676: C23.2 149.86,19.81 151.13,18.54 151.13,13.46 | R56.2 151.13,13.46 | 151.13,13.46 R57.2
N$89
  Bottom 1.676: R58.1 170.94,37.34 Q30.G
N$90
  Bottom 1.676: Q28.B 164.59,22.35 163.32,21.08 R59.2
N$91
  Bottom 1.676: Q29.G 160.02,51.82 154.69,51.82 | 154.69,51.82 140.72,51.82 139.19,50.29 C24.1 139.19,35.81 138.39,34.3 | R60.3 138.39,34.3 | 154.69,58.93 Q34.D | 154.69,58.93 Q33.D | 154.69,51.82 154.69,58.93 | R71.1 137.92,34.3 138.39,34.3
N$92
  Bottom 1.676: Q35.D 147.32,58.93 | 147.32,58.93 147.32,56.39 Q34.S | 146.05,73.41 146.05,68.33 147.32,67.06 147.32,58.93 | 146.05,73.41 C26.1 | 146.05,73.41 146.05,75.69 144.27,77.47 144.27,81.79 | 144.27,81.79 144.27,84.84 D8.A 141.22,86.36 141.22,93.34 139.95,94.61 X4.1 | 144.27,81.79 D7.C
N$93
  Bottom 1.676: 157.73,84.84 R64.3 | 157.73,84.84 157.73,80.26 158.24,77.72 C27.+ 159.26,73.66 R68.1 | R63.1 160.78,88.65 157.73,85.6 157.73,84.84
N$94
  Bottom 1.676: Q33.S 164.34,61.47 166.37,59.44 R67.2 R61.1
N$95
  Bottom 1.676: R62.2 R70.1 135.64,59.44 137.67,61.47 Q35.S
N$96
  Bottom 1.676: 140.46,66.55 Q31.C | R69.2 140.46,66.55 | 140.46,66.55 R65.1
N$97
  Bottom 1.676: 162.81,70.61 Q32.C | 162.81,70.61 C28.2 | 162.81,70.61 162.81,68.83 161.8,67.82 | 161.8,67.82 160.53,66.55 R65.2 | R66.1 162.81,66.8 161.8,67.82
N$98
  Bottom 1.676: C28.1 169.16,76.2 169.42,75.95 | 169.42,75.95 169.42,70.61 Q32.E 169.42,70.1 169.42,58.17 170.43,57.15 170.43,52.07 167.39,49.02 167.39,47.5 | 167.39,47.5 R61.2 167.39,41.15 | 169.42,76.2 169.42,82.8 | 169.42,76.2 169.42,75.95 | 169.42,82.8 J5.2 | 169.42,82.8 Q36.E | C36.1 167.92,47.5 167.39,47.5 | C29.1 169.42,76.2
N$99
  Bottom 1.676: J5.1 171.45,99.06 167.13,103.38 151.38,103.38 | C33.+ 151.38,103.38 | 151.38,103.38 132.08,103.38 130.81,102.11 130.81,97.28 129.79,96.27 123.19,96.27 | J3.1 R73.1 101.09,96.27 123.19,96.27 | 123.19,96.27 C44.2
N$100
  Bottom 1.676: R63.2 161.04,82.3 161.8,82.3 | Q36.C 161.8,82.3 | C31.2 161.8,84.75 161.8,82.3
N$101
  Bottom 1.676: Q33.G R66.2
N$102
  Bottom 1.676: R67.1 Q32.B
N$103
  Bottom 1.676: R68.2 151.13,68.07 Q34.G
N$104
  Bottom 1.676: R69.1 Q35.G
N$105
  Bottom 1.676: R70.2 135.64,69.09 138.43,71.88 Q31.B
N$106
  Bottom 1.676: X2.1 127.13,13.46 R44.1
N$107
  Bottom 1.676: X2.2 138.05,13.46 R56.1
N$108
  Bottom 1.676: X4.2 134.87,95.5 138.43,91.95 J7.1
N$110
  Bottom 1.676: C11.1 83.82,76.2 84.07,75.95 | 84.07,75.95 84.07,70.61 Q14.E 84.07,70.1 84.07,58.17 85.09,57.15 85.09,52.07 82.04,49.02 82.04,47.24 | R25.2 82.04,47.24 | R25.2 82.04,41.15 | 84.07,75.95 84.07,76.2 | 84.07,76.2 84.07,80.01 | 84.07,80.01 84.07,81.79 Q18.E | R17.2 R25.2 | 82.04,47.24 Q11.D | 84.07,80.01 J2.2 | 82.04,47.24 C37.1 | 84.07,76.2 C13.1
(copper drawn outside any net)
  shapes: Bottom area x185, Bottom circle x179, Top area x3, Top circle x24